# Altium schematic sheet MICROCONTROLLER.SchDoc: F1 STEERING  MODULE
size A; DrawnBy: GADILINGAREDDY G M; Revision: REV 2; SheetNumber: 2; SheetTotal: 4
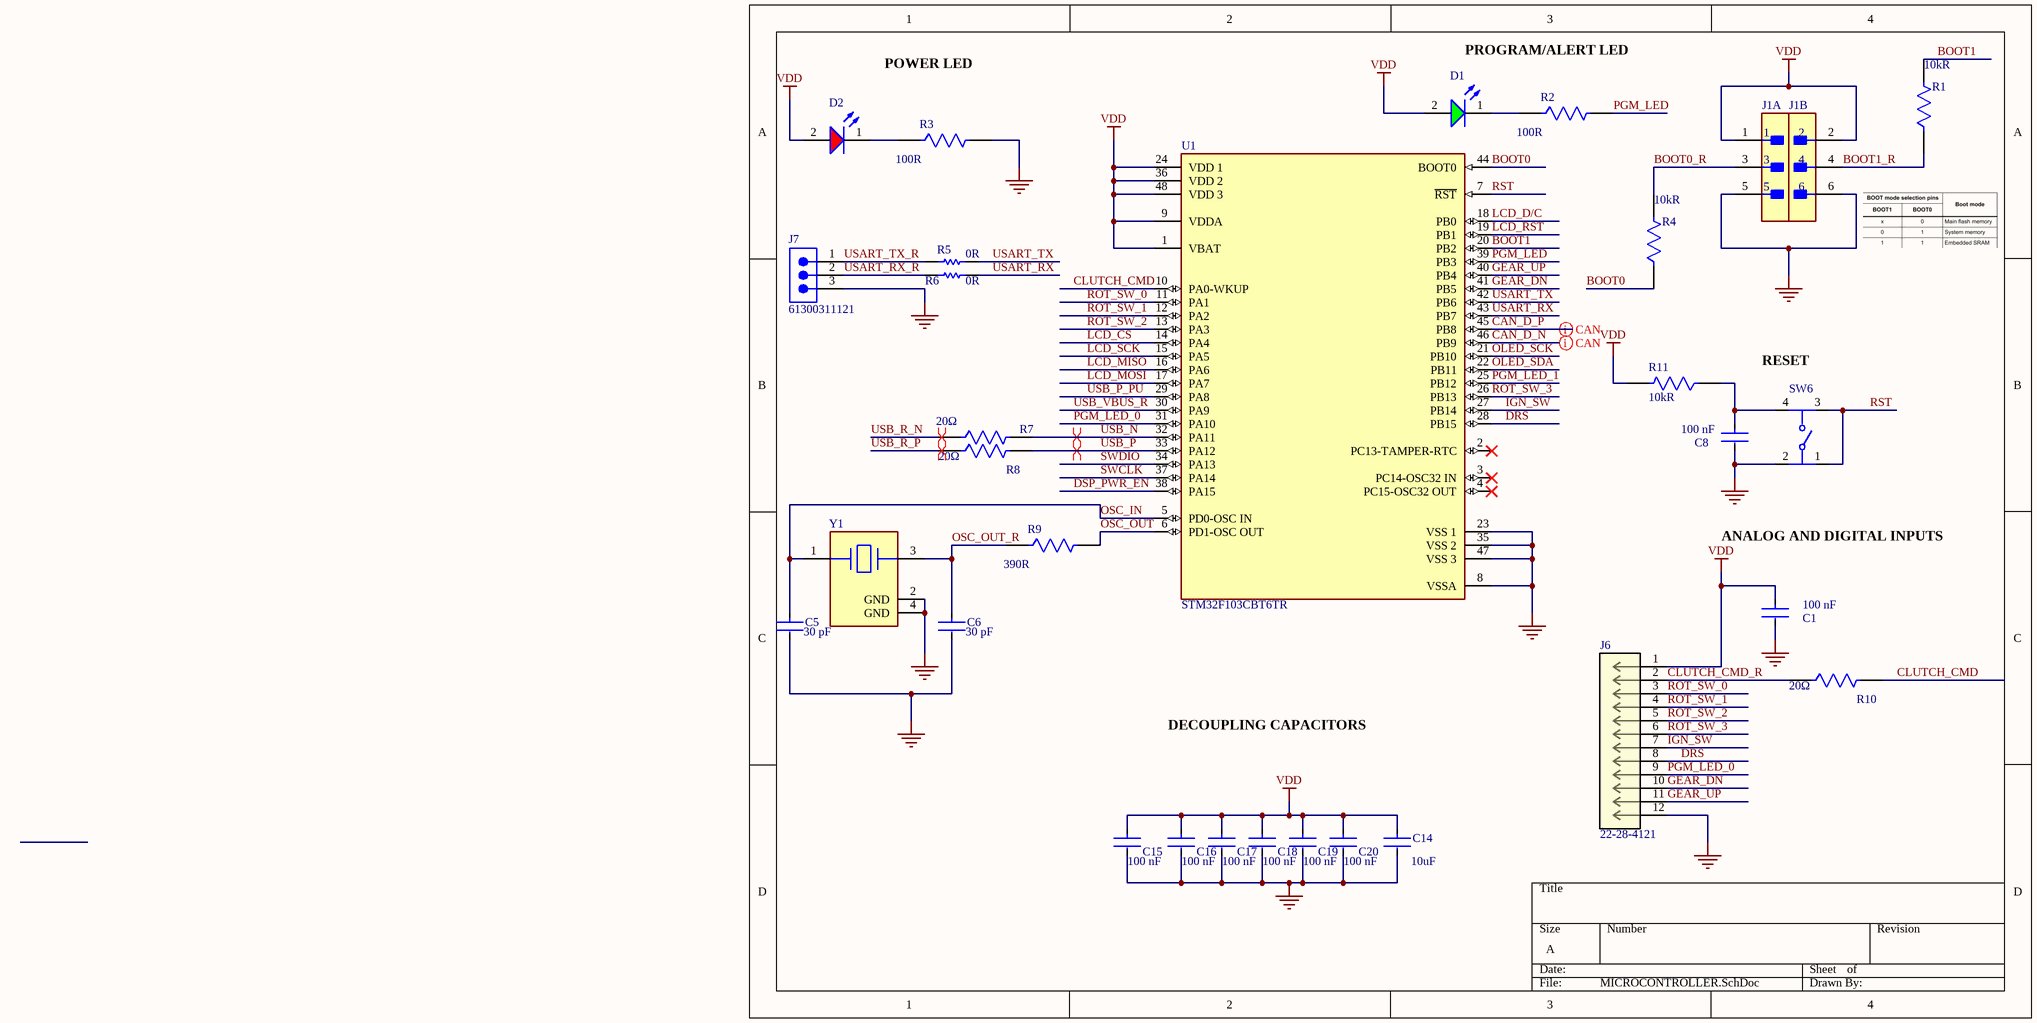
[diagram p0: MICROCONTROLLER.SchDoc]

## Parts
C1  Capacitance: 100 nF  [FP-CC0402-MFG]  (hidden comment: CC0402KRX7R7BB104)
C5  Capacitance: 30 pF  [FP-C0603C-CF-MFG]  (hidden comment: C0603C300F3HACAUTO)
C6  Capacitance: 30 pF  [FP-C0603C-CF-MFG]  (hidden comment: C0603C300F3HACAUTO)
C8  Capacitance: 100 nF  [FP-CC0402-MFG]  (hidden comment: CC0402KRX7R7BB104)
C14  Capacitance: 10uF  [FP-0805-L_2_0_0_2-W_1_25-MFG]  (hidden comment: EMK212BB7106KG-T)
C15  Capacitance: 100 nF  [FP-CC0402-MFG]  (hidden comment: CC0402KRX7R7BB104)
C16  Capacitance: 100 nF  [FP-CC0402-MFG]  (hidden comment: CC0402KRX7R7BB104)
C17  Capacitance: 100 nF  [FP-CC0402-MFG]  (hidden comment: CC0402KRX7R7BB104)
C18  Capacitance: 100 nF  [FP-CC0402-MFG]  (hidden comment: CC0402KRX7R7BB104)
C19  Capacitance: 100 nF  [FP-CC0402-MFG]  (hidden comment: CC0402KRX7R7BB104)
C20  Capacitance: 100 nF  [FP-CC0402-MFG]  (hidden comment: CC0402KRX7R7BB104)
D1  150060VS75000  [WL-SMCW_0603_150060xx75000]  (value not drawn)
D2  150080RS75000  [WL-SMCW_0805_150080xx75000]  (value not drawn)
J1  FTSH-103-01-F-DV-TR  [FP-FTSH-103-01-F-DV-TR-MFG]  (value not drawn)  (parts A,B of 2)
J6  22-28-4121  [12 POS_2.54MM_MOLEX]
J7  61300311121  [61300311121]
R1  Resistance: 10kR  [FP-RC0402-0_4-MFG]  (hidden comment: RC0402JR-0710KL)
R2  Resistance: 100R  [FP-MCS0402-MFG]  (hidden comment: MCS0402MC1000FE000)
R3  Resistance: 100R  [FP-MCS0402-MFG]  (hidden comment: MCS0402MC1000FE000)
R4  Resistance: 10kR  [FP-RC0402-0_4-MFG]  (hidden comment: RC0402JR-0710KL)
R5  Resistance: 0R  [RESC1005X40X25LL05T05]  (hidden comment: ERJ2GE0R00X)
R6  Resistance: 0R  [RESC1005X40X25LL05T05]  (hidden comment: ERJ2GE0R00X)
R7  Resistance: 20Ω  [FP-RT0402-MFG]  (hidden comment: RT0402FRE0720RL)
R8  Resistance: 20Ω  [FP-RT0402-MFG]  (hidden comment: RT0402FRE0720RL)
R9  Resistance: 390R  [FP-CRCW0402-e3-MFG]  (hidden comment: CRCW0402390RFKED)
R10  Resistance: 20Ω  [FP-RT0402-MFG]  (hidden comment: RT0402FRE0720RL)
R11  Resistance: 10kR  [FP-RC0402-0_4-MFG]  (hidden comment: RC0402JR-0710KL)
SW6  1977223-4  [FP-1977223-4-MFG]  (value not drawn)
U1  STM32F103CBT6TR  [FP-LQFP48-5B-MFG]
Y1  ABM3BAIG-8.000MHZ-1Z-T  [FP-ABM3BAIG-MFG]  (value not drawn)

## Nets
GND: C1.2 C5.2 C6.2 C8.2 C14.2 C15.2 C16.2 C17.2 C18.2 C19.2 C20.2 J1.5 J1.6 J6.12 J7.3 R3.2 SW6.2 U1.8(VSSA) U1.23(VSS_1) U1.35(VSS_2) U1.47(VSS_3) Y1.2(GND) Y1.4(GND)
VDD: C1.1 C14.1 C15.1 C16.1 C17.1 C18.1 C19.1 C20.1 D1.2(A) D2.2(A) J1.1 J1.2 J6.1 R11.2 U1.1(VBAT) U1.9(VDDA) U1.24(VDD_1) U1.36(VDD_2) U1.48(VDD_3)
BOOT0: R4.1 U1.44(BOOT0)
BOOT0_R: J1.3 R4.2
BOOT1: R1.2 U1.20(PB2)
BOOT1_R: J1.4 R1.1
CAN_D_N: U1.46(PB9)
CAN_D_P: U1.45(PB8)
CLUTCH_CMD: R10.2 U1.10(PA0-WKUP)
CLUTCH_CMD_R: J6.2 R10.1
DRS: J6.8 U1.28(PB15)
DSP_PWR_EN: U1.38(PA15)
GEAR_DN: J6.10 U1.41(PB5)
GEAR_UP: J6.11 U1.40(PB4)
IGN_SW: J6.7 U1.27(PB14)
LCD_CS: U1.14(PA4)
LCD_D/C: U1.18(PB0)
LCD_MISO: U1.16(PA6)
LCD_MOSI: U1.17(PA7)
LCD_RST: U1.19(PB1)
LCD_SCK: U1.15(PA5)
OLED_SCK: U1.21(PB10)
OLED_SDA: U1.22(PB11)
OSC_IN: C5.1 U1.5(PD0-OSC_IN) Y1.1
OSC_OUT: R9.2 U1.6(PD1-OSC_OUT)
OSC_OUT_R: C6.1 R9.1 Y1.3
PGM_LED: R2.2 U1.39(PB3)
PGM_LED_0: J6.9 U1.31(PA10)
PGM_LED_1: U1.25(PB12)
ROT_SW_0: J6.3 U1.11(PA1)
ROT_SW_1: J6.4 U1.12(PA2)
ROT_SW_2: J6.5 U1.13(PA3)
ROT_SW_3: J6.6 U1.26(PB13)
RST: SW6.1 SW6.3 U1.7(~{RST})
SWCLK: U1.37(PA14)
SWDIO: U1.34(PA13)
USART_RX: R6.2 U1.43(PB7)
USART_RX_R: J7.2 R6.1
USART_TX: R5.2 U1.42(PB6)
USART_TX_R: J7.1 R5.1
USB_N: R7.2 U1.32(PA11)
USB_P: R8.2 U1.33(PA12)
USB_P_PU: U1.29(PA8)
USB_R_N: R7.1
USB_R_P: R8.1
USB_VBUS_R: U1.30(PA9)
NetC8_1: C8.1 R11.1 SW6.4
NetD1_1: D1.1(K) R2.1
NetD2_1: D2.1(K) R3.1

Not connected (* = marked no-connect by the designer): U1 2(PC13-TAMPER-RTC)* 3(PC14-OSC32_IN)* 4(PC15-OSC32_OUT)*

## Layout directives
differential pair; differential pair class DIFF USB: USB_N, USB_P, USB_R_N, USB_R_P
differential pair; DIFF PAIR CLASS NAME: DIFF CAN: CAN_D_N, CAN_D_P

## Notes on the sheet
- POWER LED
- PROGRAM/ALERT LED
- (near SW6) RESET
- ANALOG AND DIGITAL INPUTS
- DECOUPLING CAPACITORS

## Library data of the parts
C1 C8 C15-C20 = CMP-03422-000048-1: CAP CER 0.1UF 16V X7R 0402; Manufacturer: YAGEO; Material: Ceramic; Automotive Grade: NA; Temperature Coefficient: 30ppm/°C; Tolerance: 0.1; Value: 100 nF; Device Class L1: Passive Components; Temperature Range Low: -55°C; Device Class L3: Ceramic Capacitors; Temperature Characteristic: X7R; Ipc Land Pattern Name: CAPC10050X50; Temperature Range High: +125°C; Voltage Rating: 16 V; Temperature: -55°C to +125°C; RoHS: TRUE; Automotive: No; Height: 0.55mm; Device Class L2: Capacitors; Digikey Description: CAP CER 0.1UF 16V X7R 0402; Package: CC0402; Footprint Url: http://www.yageo.com/exep/pages/download/literatures/UPY-C_GEN_24.pdf; ComponentLink2Description: Datasheet; Category: Cap; Lead Free: Yes; Octopart: https://octopart.com/cc0402krx7r7bb104-yageo-42244624; ComponentLink2URL: http://www.yageo.com/documents/recent/UPY-GP_NP0_16V-to-50V_16.pdf; Manufacturer Part Number: CC0402KRX7R7BB104; Mouser Description: 0402 0.1 uF 16 V ±10 % Tolerance X7R SMT Multilayer Ceramic Capacitor
C5 C6 = CMP-03020-002234-1: C0603 30 pF X8R 30ppm/°C 1.00% 25 V; Manufacturer: KEMET; Value: 30 pF; Automotive Grade: Grade 1; Voltage Rating: 25 V; Material: Ceramic; Tolerance: 0.01; Manufacturer Part Number: C0603C300F3HACAUTO; Temperature Range Low: -55°C; Category: Cap; Temperature: -55°C to +125°C; Temperature Coefficient: 30ppm/°C; Device Class L2: Capacitors; Device Class L3: Ceramic Capacitors; ComponentLink2Description: Datasheet; Automotive: Yes; ComponentLink2URL: https://api.kemet.com/component-edge/download/datasheet/C0603C100J5GACAUTO.pdf; Lead Free: Yes; Height: 0.87mm; Temperature Characteristic: X8R; Temperature Range High: +125°C; RoHS: TRUE; Package: C0603C-CF; Device Class L1: Passive Components; Octopart: https://octopart.com/c0603c300f3hacauto-kemet-88087312
C14 = CMP-14477-000192-1: CAP CER 10UF 16V X7R 0805; Tolerance: 10%; Case/Package: 0805; Min Operating Temperature: -55°C; Mount: Surface Mount; Length: 0.079inch; Thickness: 0.053inch; Packaging: Tape and Reel; RoHS Compliant: Yes; Width: 0.049inch; Max Operating Temperature: 125°C; Voltage Rating: 16V
D1 = CMP-1426-00006-7: WURTH ELEKTRONIK - 150060VS75000 - LED, Green, SMD, 0603, 30 mA, 2 V, 570 nm; Reverse Voltage: 5V; Power Dissipation: 72mW; Dominant Wavelength: 570nm; Peak Wavelength: 572nm; Forward Current: 100mA; Forward Voltage: 2V; Lens Style: Clear, Rectangular; Test Current: 20mA; Max Junction Temperature (Tj): 95°C; Viewing Angle: 140°; Luminous Intensity: 40mcd; Height: 700µm; Width: 800µm; Length: 1.6mm; Mount: Surface Mount; Min Operating Temperature: -40°C; Max Reverse Voltage (DC): 5V; Case Code (Imperial): 0603; Wavelength: 570nm; Color: Green; REACH SVHC: Unknown; RoHS: Compliant; Max Operating Temperature: 85°C; Packaging: Tape and Reel; Case/Package: 0603; Number of Pins: 2; Case Code (Metric): 1608
D2 = CMP-1426-00011-3: LED Uni-Color Red 630nm 2-Pin Chip 0805(2012Metric) T/R; Viewing Angle: 140°; Max Junction Temperature (Tj): 95°C; Power Dissipation: 72mW; Forward Current: 100mA; Forward Voltage: 2V; Wavelength: 625nm; Test Current: 20mA; Max Reverse Voltage (DC): 5V; Luminous Intensity: 150mcd; Lens Style: Clear, Rectangular; REACH SVHC: Unknown; Height: 700µm; Case Code (Metric): 2012; Peak Wavelength: 630nm; Length: 2mm; Width: 1.25mm; RoHS: Compliant; Packaging: Tape and Reel; Dominant Wavelength: 625nm; Color: Red; Case Code (Imperial): 0805; Min Operating Temperature: -40°C; Mount: Surface Mount; Max Operating Temperature: 85°C; Case/Package: 0805
J1 = CMP-02766-001757-1: CONN HEADER SMD 6POS 1.27MM; Number of Contacts: 6; Gender: Male; Lead Free: Lead Free; Termination: Solder; Radiation Hardening: No; Contact Shape: Square; Insulation Color: Black; Depth: 5.84mm; Flammability Rating: UL94 V-0; Series: FTSH; Contact Type: Male Pin; Fastening Type: Pull; Contact Finish - Mating: GOLD; Pitch: 1.27mm; Number of Rows: 2; Contact Plating: Gold; Orientation: Straight; Packaging: Tape and Reel; Max Operating Temperature: 125°C; Housing Material: Polymer; Number of Positions: 6; Contact Material: Bronze; Min Operating Temperature: -55°C; Length: 3.81mm; Housing Color: Black; Insulation Material: Polymer; RoHS Compliant: Yes
J6 = 22-28-4121: KK 254 Breakaway Header, Vertical, 12 Circuits, Tin (Sn) Plating, Mating Pin Length 8.13mm; Manufacturer: Molex; Manufacturer Lifecycle Status: ACTIVE; Connector Type: Male Pin; Contact Resistance: 20mΩ; Current Rating: 4A; Gender: Male; Insulation Resistance: 50GΩ; Max Voltage Rating (AC): 250V; Number of Circuits: 12; Pitch: 2.54mm; Supplier: Farnell; Supplier Part Number: 4232426; Manufacturer Part Number: 22-28-4121; RoHS: Compliant; Category: Headers and Wire Housings; Stock: 4391; Pricing: 300=0.506, 900=0.491 (EUR); China RoHS: Compliant; Color: Black; Contact Gender: Male; Contact Material: Bronze; Contact Mating Length: 8.128mm; Contact Plating: Tin; Country of Origin: US; Depth: 2.49mm; Housing Color: Black; Housing Material: Thermoplastic; Lead Free: Lead Free; Length: 30.48mm; Lifecycle Status: Production; Max Operating Temperature: 75°C; Min Operating Temperature: -40°C; Mounting Technology: Through Hole; Number of Contacts: 12; Pins: 12; Number of Positions: 12; Number of Rows: 1; Orientation: Vertical; Packaging: Bulk; Plating: Tin; REACH SVHC: Yes; Terminal Pitch: 2.54mm; Termination: Solder; ComponentLink1URL: https://datasheet.octopart.com:443/22-28-4121-Molex-datasheet-166051265.pdf?src-supplier=IHS; ComponentLink1Description: https://datasheet.octopart.com:443/22-28-4121-Molex-datasheet-166051265.pdf?src-supplier=IHS; ComponentLink2URL: https://datasheet.octopart.com:443/22-28-4121-Molex-datasheet-16300599.pdf?src-supplier=Molex; ComponentLink2Description: https://datasheet.octopart.com:443/22-28-4121-Molex-datasheet-16300599.pdf?src-supplier=Molex; ComponentLink3URL: https://sigma.octopart.com:443/16300370/technical_drawing/Molex-22-28-4121.pdf?src-supplier=Molex; ComponentLink3Description: https://sigma.octopart.com:443/16300370/technical_drawing/Molex-22-28-4121.pdf?src-supplier=Molex; ComponentLink4URL: https://datasheet.octopart.com:443/022284121-Molex-datasheet-8334776.pdf?src-supplier=Molex; ComponentLink4Description: https://datasheet.octopart.com:443/022284121-Molex-datasheet-8334776.pdf?src-supplier=Molex; ComponentLink5URL: https://datasheet.octopart.com:443/22-28-4121-Molex-datasheet-147975.pdf?src-supplier=DigiKey; ComponentLink5Description: https://datasheet.octopart.com:443/22-28-4121-Molex-datasheet-147975.pdf?src-supplier=DigiKey; ComponentLink6URL: http://sigma.octopart.com:80/16300600/rohs_statement/Molex-22-28-4121.pdf?src-supplier=Compliance+Statements; ComponentLink6Description: http://sigma.octopart.com:80/16300600/rohs_statement/Molex-22-28-4121.pdf?src-supplier=Compliance+Statements; ComponentLink7URL: http://sigma.octopart.com:80/conflict_mineral_statement/Molex-company-72.pdf?src-supplier=Compliance+Statements; ComponentLink7Description: http://sigma.octopart.com:80/conflict_mineral_statement/Molex-company-72.pdf?src-supplier=Compliance+Statements; ComponentLink8URL: http://sigma.octopart.com:80/rohs_statement/Molex-company-73.pdf?src-supplier=Compliance+Statements; ComponentLink8Description: http://sigma.octopart.com:80/rohs_statement/Molex-company-73.pdf?src-supplier=Compliance+Statements; ComponentLink9URL: http://sigma.octopart.com:80/reach_statement/Molex-company-74.pdf?src-supplier=Compliance+Statements; ComponentLink9Description: http://sigma.octopart.com:80/reach_statement/Molex-company-74.pdf?src-supplier=Compliance+Statements
J7 = CMP-1502-01062-3: CONN HEADER VERT 3POS 2.54MM; NexarPartId: 32855521; Current Rating: 3A; Voltage Rating: 250V; Number of Positions: 3; Contact Resistance: 20mΩ; Connector Type: Male Pin; Gender: Male; REACH SVHC: Unknown; Packaging: Bulk; Contact Material: Copper; Pitch: 2.54mm; Min Operating Temperature: -40°C; Number of Rows: 1; Orientation: Vertical; RoHS: Compliant; Contact Plating: Gold; Max Operating Temperature: 105°C; Mount: Through Hole; Height: 8.94mm; Operating Supply Voltage: 250V; Number of Pins: 3; Contact Mating Length: 5.9944mm; Number of Contacts: 3; Color: Black; Lead Free: Lead Free; Lead Pitch: 2.54mm; Termination: Solder
R1 R4 R11 = CMP-2002-07915-3: RES 10K OHM 5% 1/16W 0402; Max Power Dissipation: 63mW; Temperature Coefficient: 100ppm/°C; Power Rating: 62.5mW; Voltage Rating: 50V; Size Code: 0402; Resistance Tolerance: 5%; Packaging: Tape and Reel; Case Code (Metric): 1005; Lead Free: Lead Free; Resistor Type: Thick Film; Min Operating Temperature: -55°C; Military Standard: Not; Depth: 0.5mm; Series: RC; Case/Package: 0402; Construction: Rectangular; Number of Terminations: 2; Package Quantity: 1; Termination: SMD/SMT; Length: 0.039inch; Case Code (Imperial): 0402; Height: 0.016inch; Features: Moisture Resistant; RoHS Compliant: Yes; Max Operating Temperature: 155°C; Tolerance: 5%; Width: 0.02inch
R2 R3 = CMP-02407-010762-1: RES SMD 1.2K OHM 1% 1/10W 0402; Voltage Rating: 50V; Max Power Dissipation: 100mW; Temperature Coefficient: 50ppm/°C; Number of Terminations: 2; Max Operating Temperature: 175°C; Power Rating: 100mW; Case/Package: 0402; Case Code (Metric): 1005; Min Operating Temperature: -55°C; Contact Plating: Tin; Case Code (Imperial): 0402; Package Quantity: 1; Tolerance: 1%; Length: 0.039inch; Composition: Thin Film; Features: Automotive AEC-Q200; Width: 0.02inch; Weight: 2.1E-05oz; Packaging: Tape and Reel; Height: 0.015inch
R5 R6 = CMP-2000-07451-1: Chip Resistor, 0 Ohm, 0.1 W, -55 to 155 degC, 0402 (1005 Metric), RoHS, Tape and Reel; Manufacturer: Panasonic; Voltage Rating (DC): 50V; Temperature Coefficient: 600ppm/��C; Max Power Dissipation: 100mW; Tolerance: 5%; Number of Terminations: 2; Mount: SurfaceMount; Height: 0.35mm; Packaging: TapeandReel; Contact Plating: Tin; Manufacturer URL: http://www.panasonic.com/; Composition: ThickFilm; Max Operating Temperature: 155degC; REACH SVHC: NoSVHC; Case/Package: 0402; Package Reference: 402; Depth: 0.5mm; Package Description: 2-Pin Surface Mount Device, Body 1 x 0.5 mm; Datasheet URL: https://industrial.panasonic.com/cdbs/www-data/pdf/RDA0000/AOA0000C301.pdf; RoHSCompliant: True; Case Code (Imperial): 0402; Military Standard: Not; Min Operating Temperature: -55degC; Power Rating: 100mW; Datasheet Version: 03/2015; Length: 1mm; Case Code (Metric): 1005; Termination: SMD/SMT; Mounting Technology: SurfaceMount; Voltage Rating: 50V; Width: 0.02inch; Package Quantity: 1; Lead Free: LeadFree; Radiation Hardening: No; Parameter 1: *
R7 R8 R10 = CMP-2002-02569-2: RES SMD 20 OHM 1% 1/16W 0402; Manufacturer: Yageo; Value: 20Ω; Power Rating: 0.063W; Voltage Rating: 50V; Temperature Coefficient: 50 ppm/°C; Tolerance: 0.01; ComponentLink2Description: Datasheet; RoHS: TRUE; Temperature: -55°C to +155°C; Height: 0.35mm; Manufacturer Part Number: RT0402FRE0720RL; Temperature Range High: +155°C; Device Class L1: Passive Components; Automotive: No; Lead Free: Yes; ComponentLink2URL: http://www.yageo.com/documents/recent/PYu-RT_1-to-0.01_RoHS_L_9.pdf; Composition: Thin Film; Digikey Description: RES SMD 20 OHM 1% 1/16W 0402; Footprint Url: http://www.yageo.com/exep/pages/download/literatures/PYu-R_Mount_10.pdf; Series: RT; Category: Res; Octopart: https://octopart.com/rt0402fre0720rl-yageo-1278881; Temperature Range Low: -55°C; Ipc Land Pattern Name: RESC10050X30; Package: RT0402; Device Class L2: Resistors; Device Class L3: Chip SMD Resistors
R9 = CMP-1011-00463-3: RES Thick Film, 390Ω, 1%, 0.063W, 100ppm/°C, 0402; Power Rating: 63mW; Voltage Rating (DC): 50V; Military Standard: Not; Lead Free: Lead Free; Width: 0.02inch; Depth: 0.5mm; Termination: SMD/SMT; Min Operating Temperature: -55°C; Case Code (Imperial): 0402; Case/Package: 0402; Number of Terminations: 2; Package Quantity: 10; Composition: Thick Film; Case Code (Metric): 1005; Features: Automotive AEC-Q200; Packaging: Tape and Reel; Max Power Dissipation: 63mW; Max Operating Temperature: 155°C; Temperature Coefficient: 100ppm/°C; Contact Plating: Tin; Tolerance: 1%; Weight: 2.3E-05oz; Height: 0.35mm; Length: 1mm; Radiation Hardening: No; Voltage Rating: 50V
SW6 = CMP-03407-000020-1: SWITCH TACTILE SPST-NO 0.05A 12V; RoHS Compliant: Yes
U1 = CMP-0237-00247-4: ARM® Cortex®-M3 STM32F1 Microcontroller IC 32-Bit 72MHz 128KB (128K x 8) FLASH; NexarPartId: 12442975; Number of Channels: 10; Oscillator Type: Internal; Max Power Dissipation: 363mW; Number of PWM Channels: 4; Number of UART Channels: 3; RAM Size: 20kB; Number of A/D Converters: 2; Watchdog Timer: Yes; Data Bus Width: 32b; Number of Programmable I/O: 37; Peripherals: DMA, I2C, POR, PWM, Temp Sensor, WDT; Interface: CAN, I2C, IrDA, LIN, SPI, USART, USB; Number of USB Channels: 1; Core Architecture: ARM; Max Junction Temperature (Tj): 105°C; Min Supply Voltage: 2V; Nominal Supply Current: 1.7µA; Max Supply Voltage: 3.6V; Case/Package: LQFP; Length: 7mm; Min Operating Temperature: -40°C; Schedule B: 8542310000; Frequency: 72MHz; Number of USART Channels: 3; Memory Type: FLASH; Lead Free: Lead Free; Lifecycle Status: Production; RoHS: Compliant; Packaging: Tape & Reel (TR); Ambient Temperature Range High: 105°C; Flash Memory Size: 128kB; Max Operating Temperature: 85°C; Max Frequency: 72MHz; Number of SPI Channels: 2; Memory Size: 128kB; Number of Timers/Counters: 4; Radiation Hardening: No; Number of I/Os: 37; Number of Pins: 48; Number of I2C Channels: 2; Height: 1.6mm; Number of ADC Channels: 10
Y1 = CMP-27762-004085-1: CRYSTAL 8.0000MHZ 18PF SMD